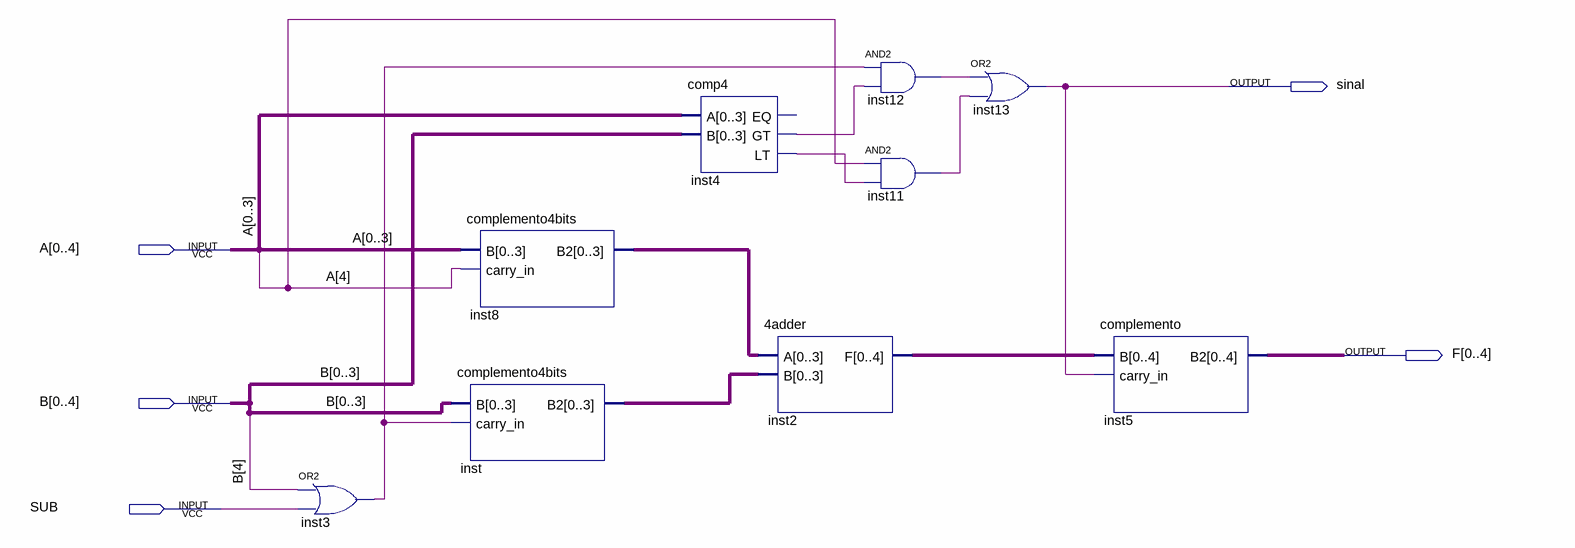
[diagram p0: schematic sheet]
// Quartus schematic somador-subtrator.bdf as structural Verilog: 9 symbols, 5 pins
module \somador-subtrator  (
  input  [0:4] A,
  input  [0:4] B,
  input  SUB,
  output sinal,
  output [0:4] F
);

  wire inst3_out, inst4_gt, inst4_lt, inst11_out, inst12_out;
  wire [3:0] inst8_b2, inst_b2;
  wire [4:0] inst2_f;

  or inst3 (inst3_out, B[4], SUB);
  complemento4bits inst8 (.B(A[0:3]), .carry_in(A[4]), .B2(inst8_b2));
  complemento4bits inst (.B(B[0:3]), .carry_in(inst3_out), .B2(inst_b2));
  comp4 inst4 (.A(A[0:3]), .B(B[0:3]), .GT(inst4_gt), .LT(inst4_lt));  // open: EQ
  \4adder  inst2 (.A(inst8_b2), .B(inst_b2), .F(inst2_f));
  and inst12 (inst12_out, inst3_out, inst4_gt);
  and inst11 (inst11_out, A[4], inst4_lt);
  or inst13 (sinal, inst12_out, inst11_out);
  complemento inst5 (.B(inst2_f), .carry_in(sinal), .B2(F));
endmodule
